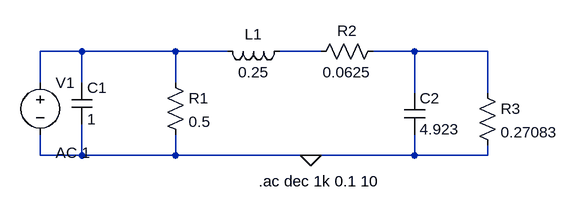
[diagram p0: schematic Draft1.asc]
Draft1.asc, the LTspice schematic file:
Version 4
SHEET 1 880 680
WIRE 96 64 32 64
WIRE 240 64 96 64
WIRE 320 64 240 64
WIRE 464 64 400 64
WIRE 608 64 544 64
WIRE 720 64 608 64
WIRE 32 112 32 64
WIRE 96 112 96 64
WIRE 240 112 240 64
WIRE 608 128 608 64
WIRE 720 128 720 64
WIRE 32 224 32 192
WIRE 96 224 96 176
WIRE 96 224 32 224
WIRE 240 224 240 192
WIRE 240 224 96 224
WIRE 448 224 240 224
WIRE 608 224 608 192
WIRE 608 224 448 224
WIRE 720 224 720 208
WIRE 720 224 608 224
FLAG 448 224 0
SYMBOL cap 80 112 R0
SYMATTR InstName C1
SYMATTR Value 1
SYMBOL res 224 96 R0
SYMATTR InstName R1
SYMATTR Value 0.5
SYMBOL ind 416 48 R90
WINDOW 0 5 56 VBottom 2
WINDOW 3 32 56 VTop 2
SYMATTR InstName L1
SYMATTR Value 0.25
SYMBOL res 560 48 R90
WINDOW 0 0 56 VBottom 2
WINDOW 3 32 56 VTop 2
SYMATTR InstName R2
SYMATTR Value 0.0625
SYMBOL cap 592 128 R0
SYMATTR InstName C2
SYMATTR Value 4.923
SYMBOL res 704 112 R0
SYMATTR InstName R3
SYMATTR Value 0.27083
SYMBOL voltage 32 96 R0
WINDOW 123 24 124 Left 2
WINDOW 39 0 0 Left 0
SYMATTR InstName V1
SYMATTR Value ""
SYMATTR Value2 AC 1
TEXT 368 264 Left 2 !.ac dec 1k 0.1 10

The netlist it stands for:
* Draft1.asc
C1 N001 0 1
R1 N001 0 0.5
L1 N002 N001 0.25
R2 N003 N002 0.0625
C2 N003 0 4.923
R3 N003 0 0.27083
V1 N001 0 AC 1
.ac dec 1k 0.1 10
.backanno
.end